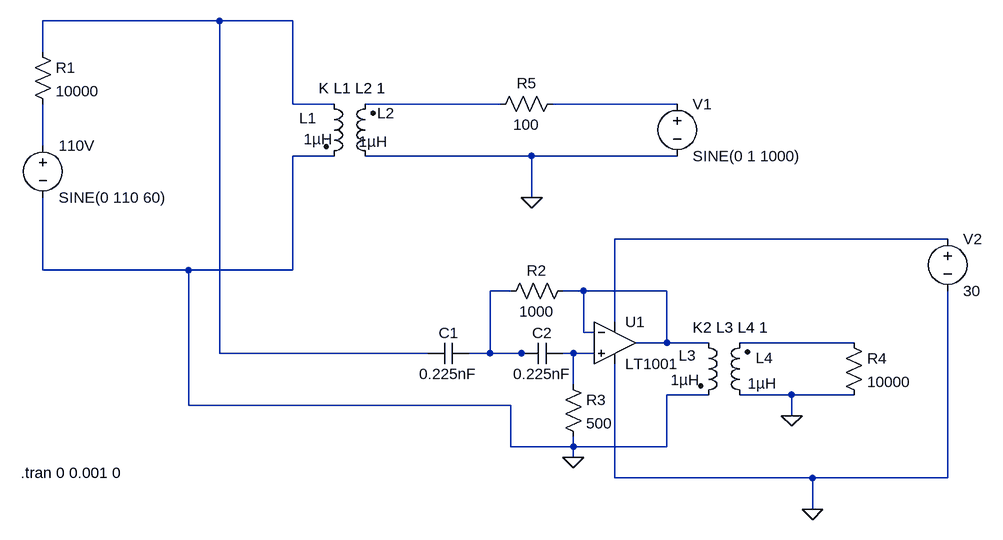
[diagram p0: schematic transformer_experiment.asc]
transformer_experiment.asc, the LTspice schematic file:
Version 4
SHEET 1 1516 680
WIRE 336 -112 64 -112
WIRE 448 -112 336 -112
WIRE 64 -64 64 -112
WIRE 448 16 448 -112
WIRE 512 16 448 16
WIRE 768 16 560 16
WIRE 1040 16 848 16
WIRE 64 80 64 16
WIRE 512 96 448 96
WIRE 816 96 560 96
WIRE 1040 96 816 96
WIRE 816 160 816 96
WIRE 1456 224 944 224
WIRE 64 272 64 160
WIRE 288 272 64 272
WIRE 448 272 448 96
WIRE 448 272 288 272
WIRE 784 304 752 304
WIRE 896 304 864 304
WIRE 1024 304 896 304
WIRE 944 352 944 224
WIRE 896 368 896 304
WIRE 912 368 896 368
WIRE 1024 384 1024 304
WIRE 1024 384 976 384
WIRE 1088 384 1024 384
WIRE 1312 384 1136 384
WIRE 336 400 336 -112
WIRE 656 400 336 400
WIRE 752 400 752 304
WIRE 752 400 720 400
WIRE 800 400 752 400
WIRE 816 400 800 400
WIRE 880 400 864 400
WIRE 912 400 880 400
WIRE 880 448 880 400
WIRE 1088 464 1024 464
WIRE 1216 464 1136 464
WIRE 1312 464 1216 464
WIRE 288 480 288 272
WIRE 784 480 288 480
WIRE 1216 496 1216 464
WIRE 784 544 784 480
WIRE 880 544 880 528
WIRE 880 544 784 544
WIRE 1024 544 1024 464
WIRE 1024 544 880 544
WIRE 880 560 880 544
WIRE 944 592 944 416
WIRE 1248 592 944 592
WIRE 1456 592 1456 304
WIRE 1456 592 1248 592
WIRE 1248 640 1248 592
FLAG 880 560 0
FLAG 816 160 0
FLAG 1216 496 0
FLAG 1248 640 0
SYMBOL voltage 64 64 R0
WINDOW 123 0 0 Left 2
WINDOW 39 0 0 Left 2
SYMATTR InstName 110V
SYMATTR Value SINE(0 110 60)
SYMBOL res 48 -80 R0
SYMATTR InstName R1
SYMATTR Value 10000
SYMBOL ind2 496 0 R0
WINDOW 0 -38 38 Left 2
WINDOW 3 -31 70 Left 2
SYMATTR InstName L1
SYMATTR Value 1µH
SYMATTR Type ind
SYMBOL ind2 576 112 R180
WINDOW 0 -29 82 Left 2
WINDOW 3 -18 38 Left 2
SYMATTR InstName L2
SYMATTR Value 1µH
SYMATTR Type ind
SYMBOL cap 720 384 R90
WINDOW 0 0 32 VBottom 2
WINDOW 3 32 32 VTop 2
SYMATTR InstName C1
SYMATTR Value 0.225nF
SYMBOL cap 864 384 R90
WINDOW 0 0 32 VBottom 2
WINDOW 3 32 32 VTop 2
SYMATTR InstName C2
SYMATTR Value 0.225nF
SYMBOL res 880 288 R90
WINDOW 0 0 56 VBottom 2
WINDOW 3 32 56 VTop 2
SYMATTR InstName R2
SYMATTR Value 1000
SYMBOL res 864 432 R0
SYMATTR InstName R3
SYMATTR Value 500
SYMBOL ind2 1072 368 R0
WINDOW 0 -30 35 Left 2
WINDOW 3 -42 73 Left 2
SYMATTR InstName L3
SYMATTR Value 1µH
SYMATTR Type ind
SYMBOL ind2 1152 480 R180
WINDOW 0 -36 73 Left 2
WINDOW 3 -41 34 Left 2
SYMATTR InstName L4
SYMATTR Value 1µH
SYMATTR Type ind
SYMBOL res 1296 368 R0
SYMATTR InstName R4
SYMATTR Value 10000
SYMBOL voltage 1040 0 R0
WINDOW 123 0 0 Left 2
WINDOW 39 0 0 Left 2
SYMATTR InstName V1
SYMATTR Value SINE(0 1 1000)
SYMBOL Opamps\\LT1001 944 320 R0
SYMATTR InstName U1
SYMBOL voltage 1456 208 R0
WINDOW 123 0 0 Left 2
WINDOW 39 0 0 Left 2
SYMATTR InstName V2
SYMATTR Value 30
SYMBOL res 864 0 R90
WINDOW 0 0 56 VBottom 2
WINDOW 3 32 56 VTop 2
SYMATTR InstName R5
SYMATTR Value 100
TEXT 488 -8 Left 2 !K L1 L2 1
TEXT 1064 360 Left 2 !K2 L3 L4 1
TEXT 30 584 Left 2 !.tran 0 0.001 0

The netlist it stands for:
* transformer_experiment.asc
V§110V N004 0 SINE(0 110 60)
R1 N001 N004 10000
L1 N001 0 1µH
L2 0 N002 1µH
C1 N006 N001 0.225nF
C2 N009 N006 0.225nF
R2 N007 N006 1000
R3 N009 0 500
L3 N007 0 1µH
L4 0 N008 1µH
R4 N008 0 10000
V1 N003 0 SINE(0 1 1000)
XU1 N009 N007 N005 0 N007 LT1001  ; pins In+ In- V+ V- OUT
V2 N005 0 30
R5 N003 N002 100
K L1 L2 1
K2 L3 L4 1
.tran 0 0.001 0
.lib LTC.lib
.backanno
.end